# EAGLE schematic MultiSensor_MPL (EAGLE 9.5.2)
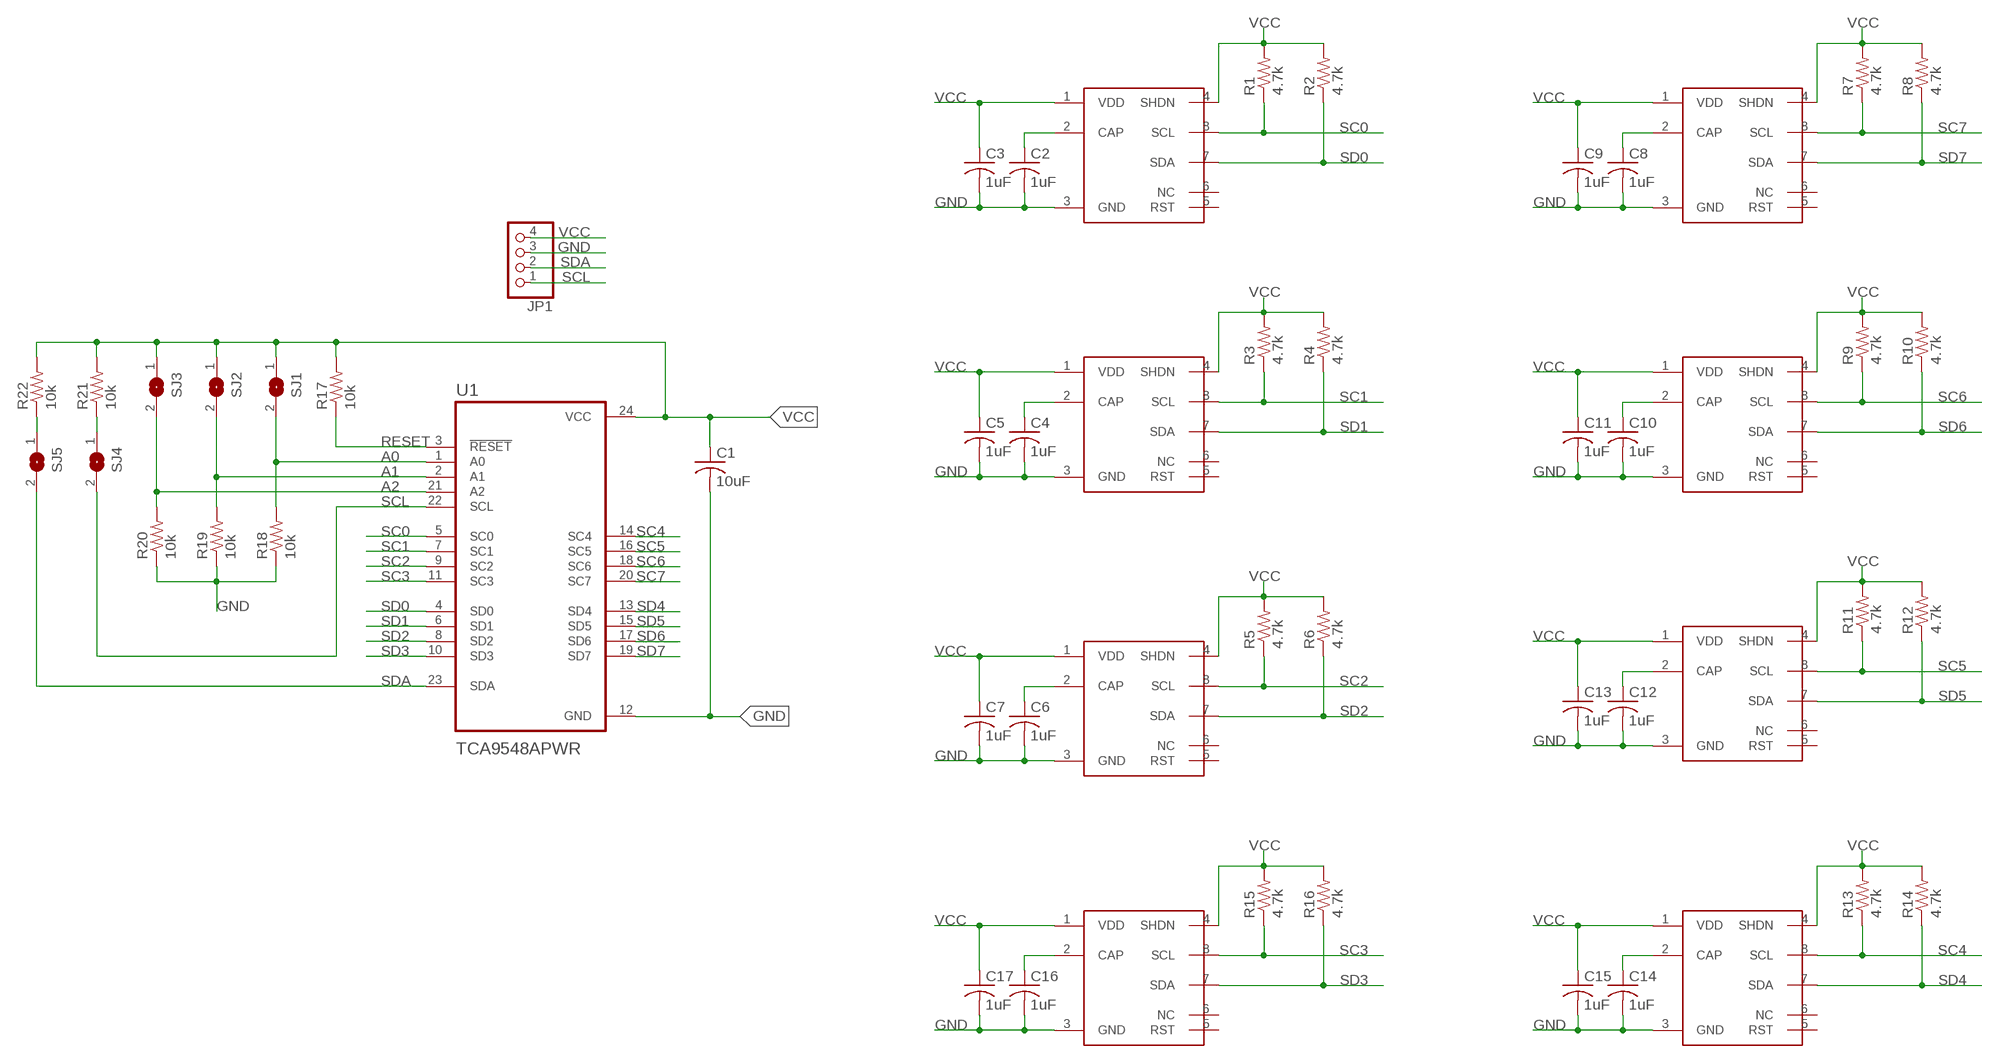
[diagram p0: schematic, sheet 1]

## Parts
B1  MPL115A2T1  [MPL115A2T1]
B2  MPL115A2T1  [MPL115A2T1]
B3  MPL115A2T1  [MPL115A2T1]
B4  MPL115A2T1  [MPL115A2T1]
B5  MPL115A2T1  [MPL115A2T1]
B6  MPL115A2T1  [MPL115A2T1]
B7  MPL115A2T1  [MPL115A2T1]
B8  MPL115A2T1  [MPL115A2T1]
C1  10uF  C-USC0805  [C0805]
C2  1uF  C-USC0805  [C0805]
C3  1uF  C-USC0805  [C0805]
C4  1uF  C-USC0805  [C0805]
C5  1uF  C-USC0805  [C0805]
C6  1uF  C-USC0805  [C0805]
C7  1uF  C-USC0805  [C0805]
C8  1uF  C-USC0805  [C0805]
C9  1uF  C-USC0805  [C0805]
C10  1uF  C-USC0805  [C0805]
C11  1uF  C-USC0805  [C0805]
C12  1uF  C-USC0805  [C0805]
C13  1uF  C-USC0805  [C0805]
C14  1uF  C-USC0805  [C0805]
C15  1uF  C-USC0805  [C0805]
C16  1uF  C-USC0805  [C0805]
C17  1uF  C-USC0805  [C0805]
JP1  PINHD-1X4  [1X04]
R1  4.7k  R-US_R0805  [R0805]
R2  4.7k  R-US_R0805  [R0805]
R3  4.7k  R-US_R0805  [R0805]
R4  4.7k  R-US_R0805  [R0805]
R5  4.7k  R-US_R0805  [R0805]
R6  4.7k  R-US_R0805  [R0805]
R7  4.7k  R-US_R0805  [R0805]
R8  4.7k  R-US_R0805  [R0805]
R9  4.7k  R-US_R0805  [R0805]
R10  4.7k  R-US_R0805  [R0805]
R11  4.7k  R-US_R0805  [R0805]
R12  4.7k  R-US_R0805  [R0805]
R13  4.7k  R-US_R0805  [R0805]
R14  4.7k  R-US_R0805  [R0805]
R15  4.7k  R-US_R0805  [R0805]
R16  4.7k  R-US_R0805  [R0805]
R17  10k  R-US_R0805  [R0805]
R18  10k  R-US_R0805  [R0805]
R19  10k  R-US_R0805  [R0805]
R20  10k  R-US_R0805  [R0805]
R21  10k  R-US_R0805  [R0805]
R22  10k  R-US_R0805  [R0805]
SJ1  SJ  [SJ]
SJ2  SJ  [SJ]
SJ3  SJ  [SJ]
SJ4  SJ  [SJ]
SJ5  SJ  [SJ]
U1  TCA9548APWR  [SOP65P640X120-24N]

## Nets
A0: R18.2 SJ1.2 U1.1(A0)
A1: R19.2 SJ2.2 U1.2(A1)
A2: R20.2 SJ3.2 U1.21(A2)
GND: B1.3(GND) B2.3(GND) B3.3(GND) B4.3(GND) B5.3(GND) B6.3(GND) B7.3(GND) B8.3(GND) C1.2 C2.2 C3.2 C4.2 C5.2 C6.2 C7.2 C8.2 C9.2 C10.2 C11.2 C12.2 C13.2 C14.2 C15.2 C16.2 C17.2 JP1.3 R18.1 R19.1 R20.1 U1.12(GND)
N$1: R22.1 SJ5.1
N$2: R21.1 SJ4.1
N$3: B1.2(CAP) C2.1
N$4: B2.2(CAP) C4.1
N$5: B3.2(CAP) C6.1
N$6: B4.2(CAP) C8.1
N$7: B5.2(CAP) C10.1
N$8: B6.2(CAP) C12.1
N$9: B7.2(CAP) C14.1
N$10: B8.2(CAP) C16.1
RESET: R17.1 U1.3(!RESET)
SC0: B1.8(SCL) R1.1 U1.5(SC0)
SC1: B2.8(SCL) R3.1 U1.7(SC1)
SC2: B3.8(SCL) R5.1 U1.9(SC2)
SC3: B8.8(SCL) R15.1 U1.11(SC3)
SC4: B7.8(SCL) R13.1 U1.14(SC4)
SC5: B6.8(SCL) R11.1 U1.16(SC5)
SC6: B5.8(SCL) R9.1 U1.18(SC6)
SC7: B4.8(SCL) R7.1 U1.20(SC7)
SCL: JP1.1 SJ4.2 U1.22(SCL)
SD0: B1.7(SDA) R2.1 U1.4(SD0)
SD1: B2.7(SDA) R4.1 U1.6(SD1)
SD2: B3.7(SDA) R6.1 U1.8(SD2)
SD3: B8.7(SDA) R16.1 U1.10(SD3)
SD4: B7.7(SDA) R14.1 U1.13(SD4)
SD5: B6.7(SDA) R12.1 U1.15(SD5)
SD6: B5.7(SDA) R10.1 U1.17(SD6)
SD7: B4.7(SDA) R8.1 U1.19(SD7)
SDA: JP1.2 SJ5.2 U1.23(SDA)
VCC: B1.1(VDD) B1.4(SHDN) B2.1(VDD) B2.4(SHDN) B3.1(VDD) B3.4(SHDN) B4.1(VDD) B4.4(SHDN) B5.1(VDD) B5.4(SHDN) B6.1(VDD) B6.4(SHDN) B7.1(VDD) B7.4(SHDN) B8.1(VDD) B8.4(SHDN) C1.1 C3.1 C5.1 C7.1 C9.1 C11.1 C13.1 C15.1 C17.1 JP1.4 R1.2 R2.2 R3.2 R4.2 R5.2 R6.2 R7.2 R8.2 R9.2 R10.2 R11.2 R12.2 R13.2 R14.2 R15.2 R16.2 R17.2 R21.2 R22.2 SJ1.1 SJ2.1 SJ3.1 U1.24(VCC)
Unconnected: B1.5(RST) B1.6(NC) B2.5(RST) B2.6(NC) B3.5(RST) B3.6(NC) B4.5(RST) B4.6(NC) B5.5(RST) B5.6(NC) B6.5(RST) B6.6(NC) B7.5(RST) B7.6(NC) B8.5(RST) B8.6(NC)

## Library data of the parts
B1-B8 = MPL115A2T1:MPL115A2T1: MEMS Barometer from NXP Semiconductors. DATASHEET: https://www.nxp.com/docs/en/data-sheet/MPL115A2.pdf
C1-C17 = rcl:C-US: CAPACITOR, American symbol; SPICEPREFIX: C
JP1 = pinhead:PINHD-1X4: PIN HEADER
R1-R16 = rcl:R-US_: RESISTOR, American symbol; SPICEPREFIX: R
R17-R22 = resistor:R-US_: RESISTOR, American symbol
SJ1-SJ5 = jumper:SJ: SMD solder JUMPER
U1 = TCA9548APWR:TCA9548APWR; DESCRIPTION: Low-Voltage 8-Channel I2C Switch With Reset 24-TSSOP -40 to 85; DIGI-KEY_PART_NUMBER: 296-34905-1-ND; MF: Texas Instruments; MP: TCA9548APWR; PACKAGE: TSSOP-24 Texas Instruments; PURCHASE-URL: https://pricing.snapeda.com/search/part/TCA9548APWR/?ref=eda